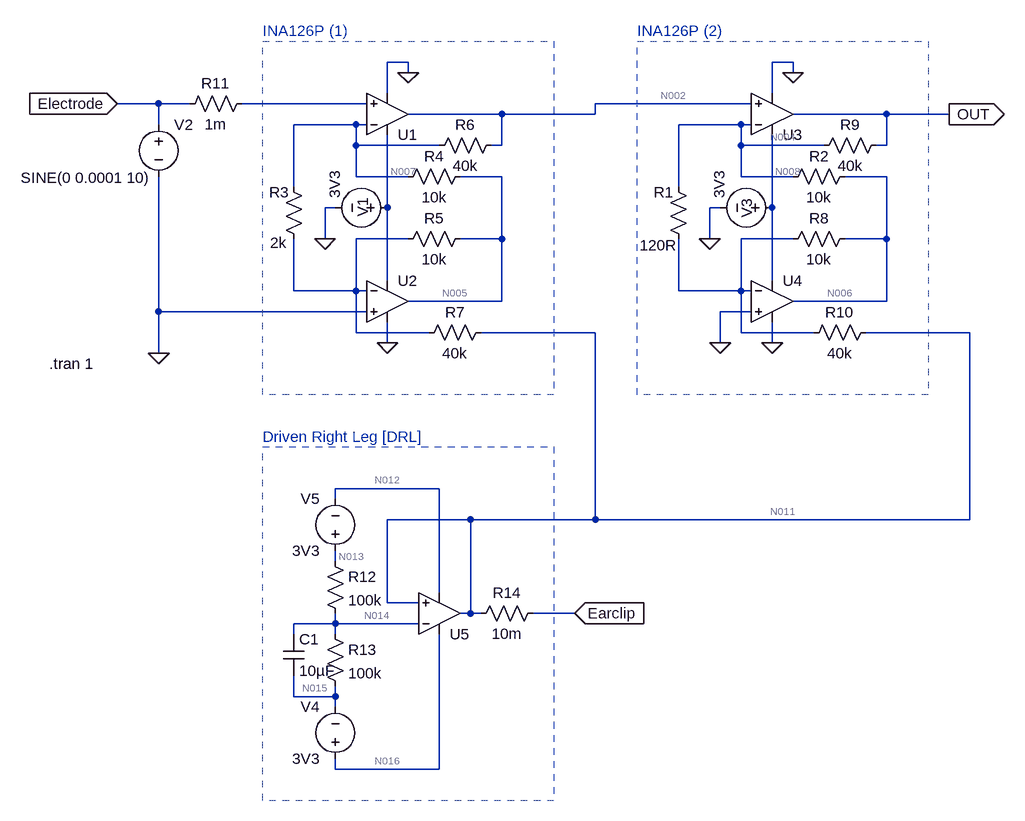
[diagram p0: schematic Draft2.asc]
Draft2.asc, the LTspice schematic file:
Version 4
SHEET 1 2096 1188
WIRE 784 48 752 48
WIRE 1376 48 1344 48
WIRE 784 64 784 48
WIRE 1376 64 1376 48
WIRE 752 96 752 48
WIRE 1344 96 1344 48
WIRE 400 112 336 112
WIRE 448 112 400 112
WIRE 720 112 528 112
WIRE 1312 112 1072 112
WIRE 928 128 784 128
WIRE 1072 128 1072 112
WIRE 1072 128 928 128
WIRE 1520 128 1376 128
WIRE 1616 128 1520 128
WIRE 400 144 400 112
WIRE 704 144 608 144
WIRE 720 144 704 144
WIRE 1296 144 1200 144
WIRE 1312 144 1296 144
WIRE 704 176 704 144
WIRE 832 176 704 176
WIRE 928 176 928 128
WIRE 928 176 912 176
WIRE 1296 176 1296 144
WIRE 1424 176 1296 176
WIRE 1520 176 1520 128
WIRE 1520 176 1504 176
WIRE 704 224 704 176
WIRE 784 224 704 224
WIRE 928 224 864 224
WIRE 1296 224 1296 176
WIRE 1376 224 1296 224
WIRE 1520 224 1456 224
WIRE 608 240 608 144
WIRE 1200 240 1200 144
WIRE 672 272 656 272
WIRE 752 272 752 160
WIRE 1264 272 1248 272
WIRE 1344 272 1344 160
WIRE 656 320 656 272
WIRE 784 320 704 320
WIRE 928 320 928 224
WIRE 928 320 864 320
WIRE 1248 320 1248 272
WIRE 1376 320 1296 320
WIRE 1520 320 1520 224
WIRE 1520 320 1456 320
WIRE 752 384 752 272
WIRE 1344 384 1344 272
WIRE 608 400 608 320
WIRE 704 400 704 320
WIRE 704 400 608 400
WIRE 720 400 704 400
WIRE 1200 400 1200 320
WIRE 1296 400 1296 320
WIRE 1296 400 1200 400
WIRE 1312 400 1296 400
WIRE 928 416 928 320
WIRE 928 416 784 416
WIRE 1520 416 1520 320
WIRE 1520 416 1376 416
WIRE 400 432 400 224
WIRE 720 432 400 432
WIRE 1312 432 1264 432
WIRE 704 464 704 400
WIRE 816 464 704 464
WIRE 1072 464 896 464
WIRE 1296 464 1296 400
WIRE 1408 464 1296 464
WIRE 1648 464 1488 464
WIRE 752 480 752 448
WIRE 1264 480 1264 432
WIRE 1344 480 1344 448
WIRE 400 496 400 432
WIRE 832 704 672 704
WIRE 672 720 672 704
WIRE 880 752 752 752
WIRE 1072 752 1072 464
WIRE 1072 752 880 752
WIRE 1648 752 1648 464
WIRE 1648 752 1072 752
WIRE 672 816 672 800
WIRE 832 864 832 704
WIRE 752 880 752 752
WIRE 800 880 752 880
WIRE 880 896 880 752
WIRE 880 896 864 896
WIRE 896 896 880 896
WIRE 1040 896 976 896
WIRE 672 912 672 896
WIRE 672 912 608 912
WIRE 800 912 672 912
WIRE 608 928 608 912
WIRE 672 928 672 912
WIRE 608 1024 608 992
WIRE 672 1024 672 1008
WIRE 672 1024 608 1024
WIRE 672 1040 672 1024
WIRE 672 1136 672 1120
WIRE 832 1136 832 928
WIRE 832 1136 672 1136
FLAG 336 112 Electrode
IOPIN 336 112 In
FLAG 656 320 0
FLAG 784 64 0
FLAG 752 480 0
FLAG 1248 320 0
FLAG 1376 64 0
FLAG 1344 480 0
FLAG 1616 128 OUT
IOPIN 1616 128 Out
FLAG 1264 480 0
FLAG 400 496 0
FLAG 1040 896 Earclip
IOPIN 1040 896 In
SYMBOL OpAmps\\UniversalOpAmp 752 128 M180
SYMATTR InstName U1
SYMBOL voltage 768 272 R90
WINDOW 0 -15 54 Left 2
WINDOW 3 -57 97 Left 2
WINDOW 123 0 0 Left 0
WINDOW 39 0 0 Left 0
SYMATTR InstName V1
SYMATTR Value 3V3
SYMBOL OpAmps\\UniversalOpAmp 752 416 R0
SYMATTR InstName U2
SYMBOL res 592 224 R0
WINDOW 0 -22 24 Left 2
WINDOW 3 -20 102 Left 2
SYMATTR InstName R3
SYMATTR Value 2k
SYMATTR SpiceLine tol=1
SYMBOL res 880 208 R90
WINDOW 0 0 56 VBottom 2
WINDOW 3 32 56 VTop 2
SYMATTR InstName R4
SYMATTR Value 10k
SYMATTR SpiceLine tol=1
SYMBOL res 880 304 R90
WINDOW 0 0 56 VBottom 2
WINDOW 3 32 56 VTop 2
SYMATTR InstName R5
SYMATTR Value 10k
SYMATTR SpiceLine tol=1
SYMBOL res 928 160 R90
WINDOW 0 0 56 VBottom 2
WINDOW 3 32 56 VTop 2
SYMATTR InstName R6
SYMATTR Value 40k
SYMATTR SpiceLine tol=1
SYMBOL res 912 448 R90
WINDOW 0 0 56 VBottom 2
WINDOW 3 32 56 VTop 2
SYMATTR InstName R7
SYMATTR Value 40k
SYMATTR SpiceLine tol=1
SYMBOL voltage 400 128 R0
WINDOW 3 -212 98 Left 2
WINDOW 123 0 0 Left 0
WINDOW 39 0 0 Left 0
SYMATTR Value SINE(0 0.0001 10)
SYMATTR InstName V2
SYMBOL OpAmps\\UniversalOpAmp 1344 128 M180
SYMATTR InstName U3
SYMBOL voltage 1360 272 R90
WINDOW 0 -14 55 Left 2
WINDOW 3 -57 97 Left 2
WINDOW 123 0 0 Left 0
WINDOW 39 0 0 Left 0
SYMATTR InstName V3
SYMATTR Value 3V3
SYMBOL OpAmps\\UniversalOpAmp 1344 416 R0
SYMATTR InstName U4
SYMBOL res 1184 224 R0
WINDOW 0 -22 24 Left 2
WINDOW 3 -44 106 Left 2
SYMATTR InstName R1
SYMATTR Value 120R
SYMATTR SpiceLine tol=1
SYMBOL res 1472 208 R90
WINDOW 0 0 56 VBottom 2
WINDOW 3 32 56 VTop 2
SYMATTR InstName R2
SYMATTR Value 10k
SYMATTR SpiceLine tol=1
SYMBOL res 1472 304 R90
WINDOW 0 0 56 VBottom 2
WINDOW 3 32 56 VTop 2
SYMATTR InstName R8
SYMATTR Value 10k
SYMATTR SpiceLine tol=1
SYMBOL res 1520 160 R90
WINDOW 0 0 56 VBottom 2
WINDOW 3 32 56 VTop 2
SYMATTR InstName R9
SYMATTR Value 40k
SYMATTR SpiceLine tol=1
SYMBOL res 1504 448 R90
WINDOW 0 0 56 VBottom 2
WINDOW 3 32 56 VTop 2
SYMATTR InstName R10
SYMATTR Value 40k
SYMATTR SpiceLine tol=1
SYMBOL res 544 96 R90
WINDOW 0 0 56 VBottom 2
WINDOW 3 32 56 VTop 2
SYMATTR InstName R11
SYMATTR Value 1m
SYMATTR SpiceLine tol=1
SYMBOL OpAmps\\UniversalOpAmp 832 896 M180
SYMATTR InstName U5
SYMBOL res 656 800 R0
SYMATTR InstName R12
SYMATTR Value 100k
SYMATTR SpiceLine tol=1
SYMBOL res 656 912 R0
SYMATTR InstName R13
SYMATTR Value 100k
SYMATTR SpiceLine tol=1
SYMBOL cap 592 928 R0
SYMATTR InstName C1
SYMATTR Value 10µF
SYMATTR SpiceLine V=50
SYMBOL voltage 672 1136 R180
WINDOW 0 24 96 Left 2
WINDOW 3 24 16 Left 2
WINDOW 123 0 0 Left 0
WINDOW 39 0 0 Left 0
SYMATTR InstName V4
SYMATTR Value 3V3
SYMBOL voltage 672 816 R180
WINDOW 0 24 96 Left 2
WINDOW 3 24 16 Left 2
WINDOW 123 0 0 Left 0
WINDOW 39 0 0 Left 0
SYMATTR InstName V5
SYMATTR Value 3V3
SYMBOL res 992 880 R90
WINDOW 0 0 56 VBottom 2
WINDOW 3 32 56 VTop 2
SYMATTR InstName R14
SYMATTR Value 10m
SYMATTR SpiceLine tol=1
TEXT 232 512 Left 2 !.tran 1
TEXT 560 0 Left 2 ;INA126P (1)
TEXT 1136 0 Left 2 ;INA126P (2)
TEXT 560 624 Left 2 ;Driven Right Leg [DRL]
RECTANGLE Normal 1008 560 560 16 2
RECTANGLE Normal 1584 560 1136 16 2
RECTANGLE Normal 1008 1184 560 640 2

The netlist it stands for:
* Draft2.asc
XU1 N001 N003 N007 0 N002 level1 Avol=1Meg GBW=10Meg Vos=0 En=0 Enk=0 In=0 Ink=0 Rin=500Meg  ; pins In+ In- V+ V- OUT
V1 N007 0 3V3
XU2 0 N009 N007 0 N005 level1 Avol=1Meg GBW=10Meg Vos=0 En=0 Enk=0 In=0 Ink=0 Rin=500Meg  ; pins In+ In- V+ V- OUT
R3 N003 N009 2k tol=1
R4 N005 N003 10k tol=1
R5 N005 N009 10k tol=1
R6 N002 N003 40k tol=1
R7 N011 N009 40k tol=1
V2 Electrode 0 SINE(0 0.0001 10)
XU3 N002 N004 N008 0 OUT level1 Avol=1Meg GBW=10Meg Vos=0 En=0 Enk=0 In=0 Ink=0 Rin=500Meg  ; pins In+ In- V+ V- OUT
V3 N008 0 3V3
XU4 0 N010 N008 0 N006 level1 Avol=1Meg GBW=10Meg Vos=0 En=0 Enk=0 In=0 Ink=0 Rin=500Meg  ; pins In+ In- V+ V- OUT
R1 N004 N010 120R tol=1
R2 N006 N004 10k tol=1
R8 N006 N010 10k tol=1
R9 OUT N004 40k tol=1
R10 N011 N010 40k tol=1
R11 N001 Electrode 1m tol=1
XU5 N011 N014 N016 N012 N011 level1 Avol=1Meg GBW=10Meg Vos=0 En=0 Enk=0 In=0 Ink=0 Rin=500Meg  ; pins In+ In- V+ V- OUT
R12 N013 N014 100k tol=1
R13 N014 N015 100k tol=1
C1 N014 N015 10µF V=50
V4 N016 N015 3V3
V5 N013 N012 3V3
R14 Earclip N011 10m tol=1
.tran 1
* INA126P (1)
* INA126P (2)
* Driven Right Leg [DRL]
.lib UniversalOpAmp1.lib
.backanno
.end

* Results of the author's LTspice run, read from the files saved beside the schematic
* Operating Point, zero values left out:
*   V(n002) = -1.695 µV
*   V(n007) = 3 V
*   V(n005) = -29.58 µV
*   V(n011) = -1.694 µV
*   V(n004) = -1.694 µV
*   V(out) = -1.14 mV
*   V(n008) = 3 V
*   V(n006) = 111.6 µV
*   V(n014) = -1.694 µV
*   V(n016) = 2.999 V
*   V(n012) = -2.999 V
*   V(n013) = 598.2 µV
*   V(n015) = -601.6 µV
*   V(earclip) = -1.694 µV
*   I(R13) = 5.999 nA
*   I(R12) = 5.999 nA
*   I(R11) = 3 nA
*   I(R10) = -42.35 pA
*   I(R9) = -28.45 nA
*   I(R8) = 11.16 nA
*   I(R2) = 11.33 nA
*   I(R1) = -14.12 nA
*   I(R7) = -42.36 pA
*   I(R6) = -42.38 pA
*   I(R5) = -2.958 nA
*   I(R4) = -2.958 nA
*   I(V5) = -5.999 nA
*   I(V4) = -5.999 nA
*   I(V3) = -12 nA
*   I(V2) = 3 nA
*   I(V1) = -12 nA
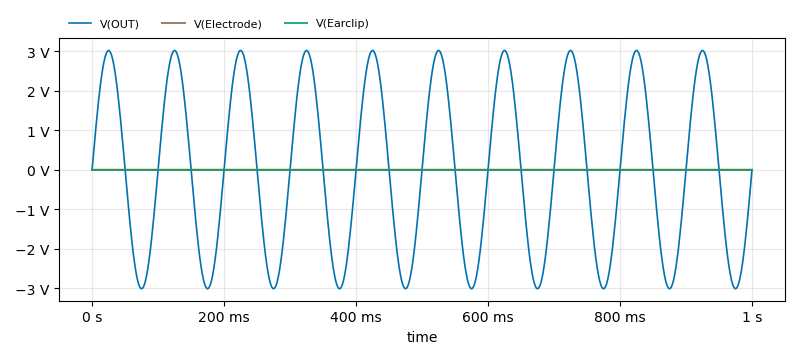
[diagram p1: Transient Analysis of Draft2.asc, plotted from the saved traces]
* Transient Analysis, 1 run:
*   V(OUT): min -3.017 V, max 3.018 V, average 466.8 µV, rms 2.134 V, last -1.918 mV
*   V(Electrode): min -100 µV, max 100 µV, average 19.72 pV, rms 70.71 µV, last 0 V
*   V(Earclip): min -1.774 µV, max 958.8 nV, average 694.8 nV, rms 806.2 nV, last 761.4 nV